# Altium schematic sheet ORD_FV1.SchDoc
size 420 x 297 mm; Address1: Address1; Address2: Address2; Address3: Address3; Address4: Address4; DocumentNumber: АБВГ.123456.001 Э3; SheetNumber: 1; Scale: 1:1; DocumentType: Схема электрическая принципиальная; FirstReferrence: АБВГ.123456.001
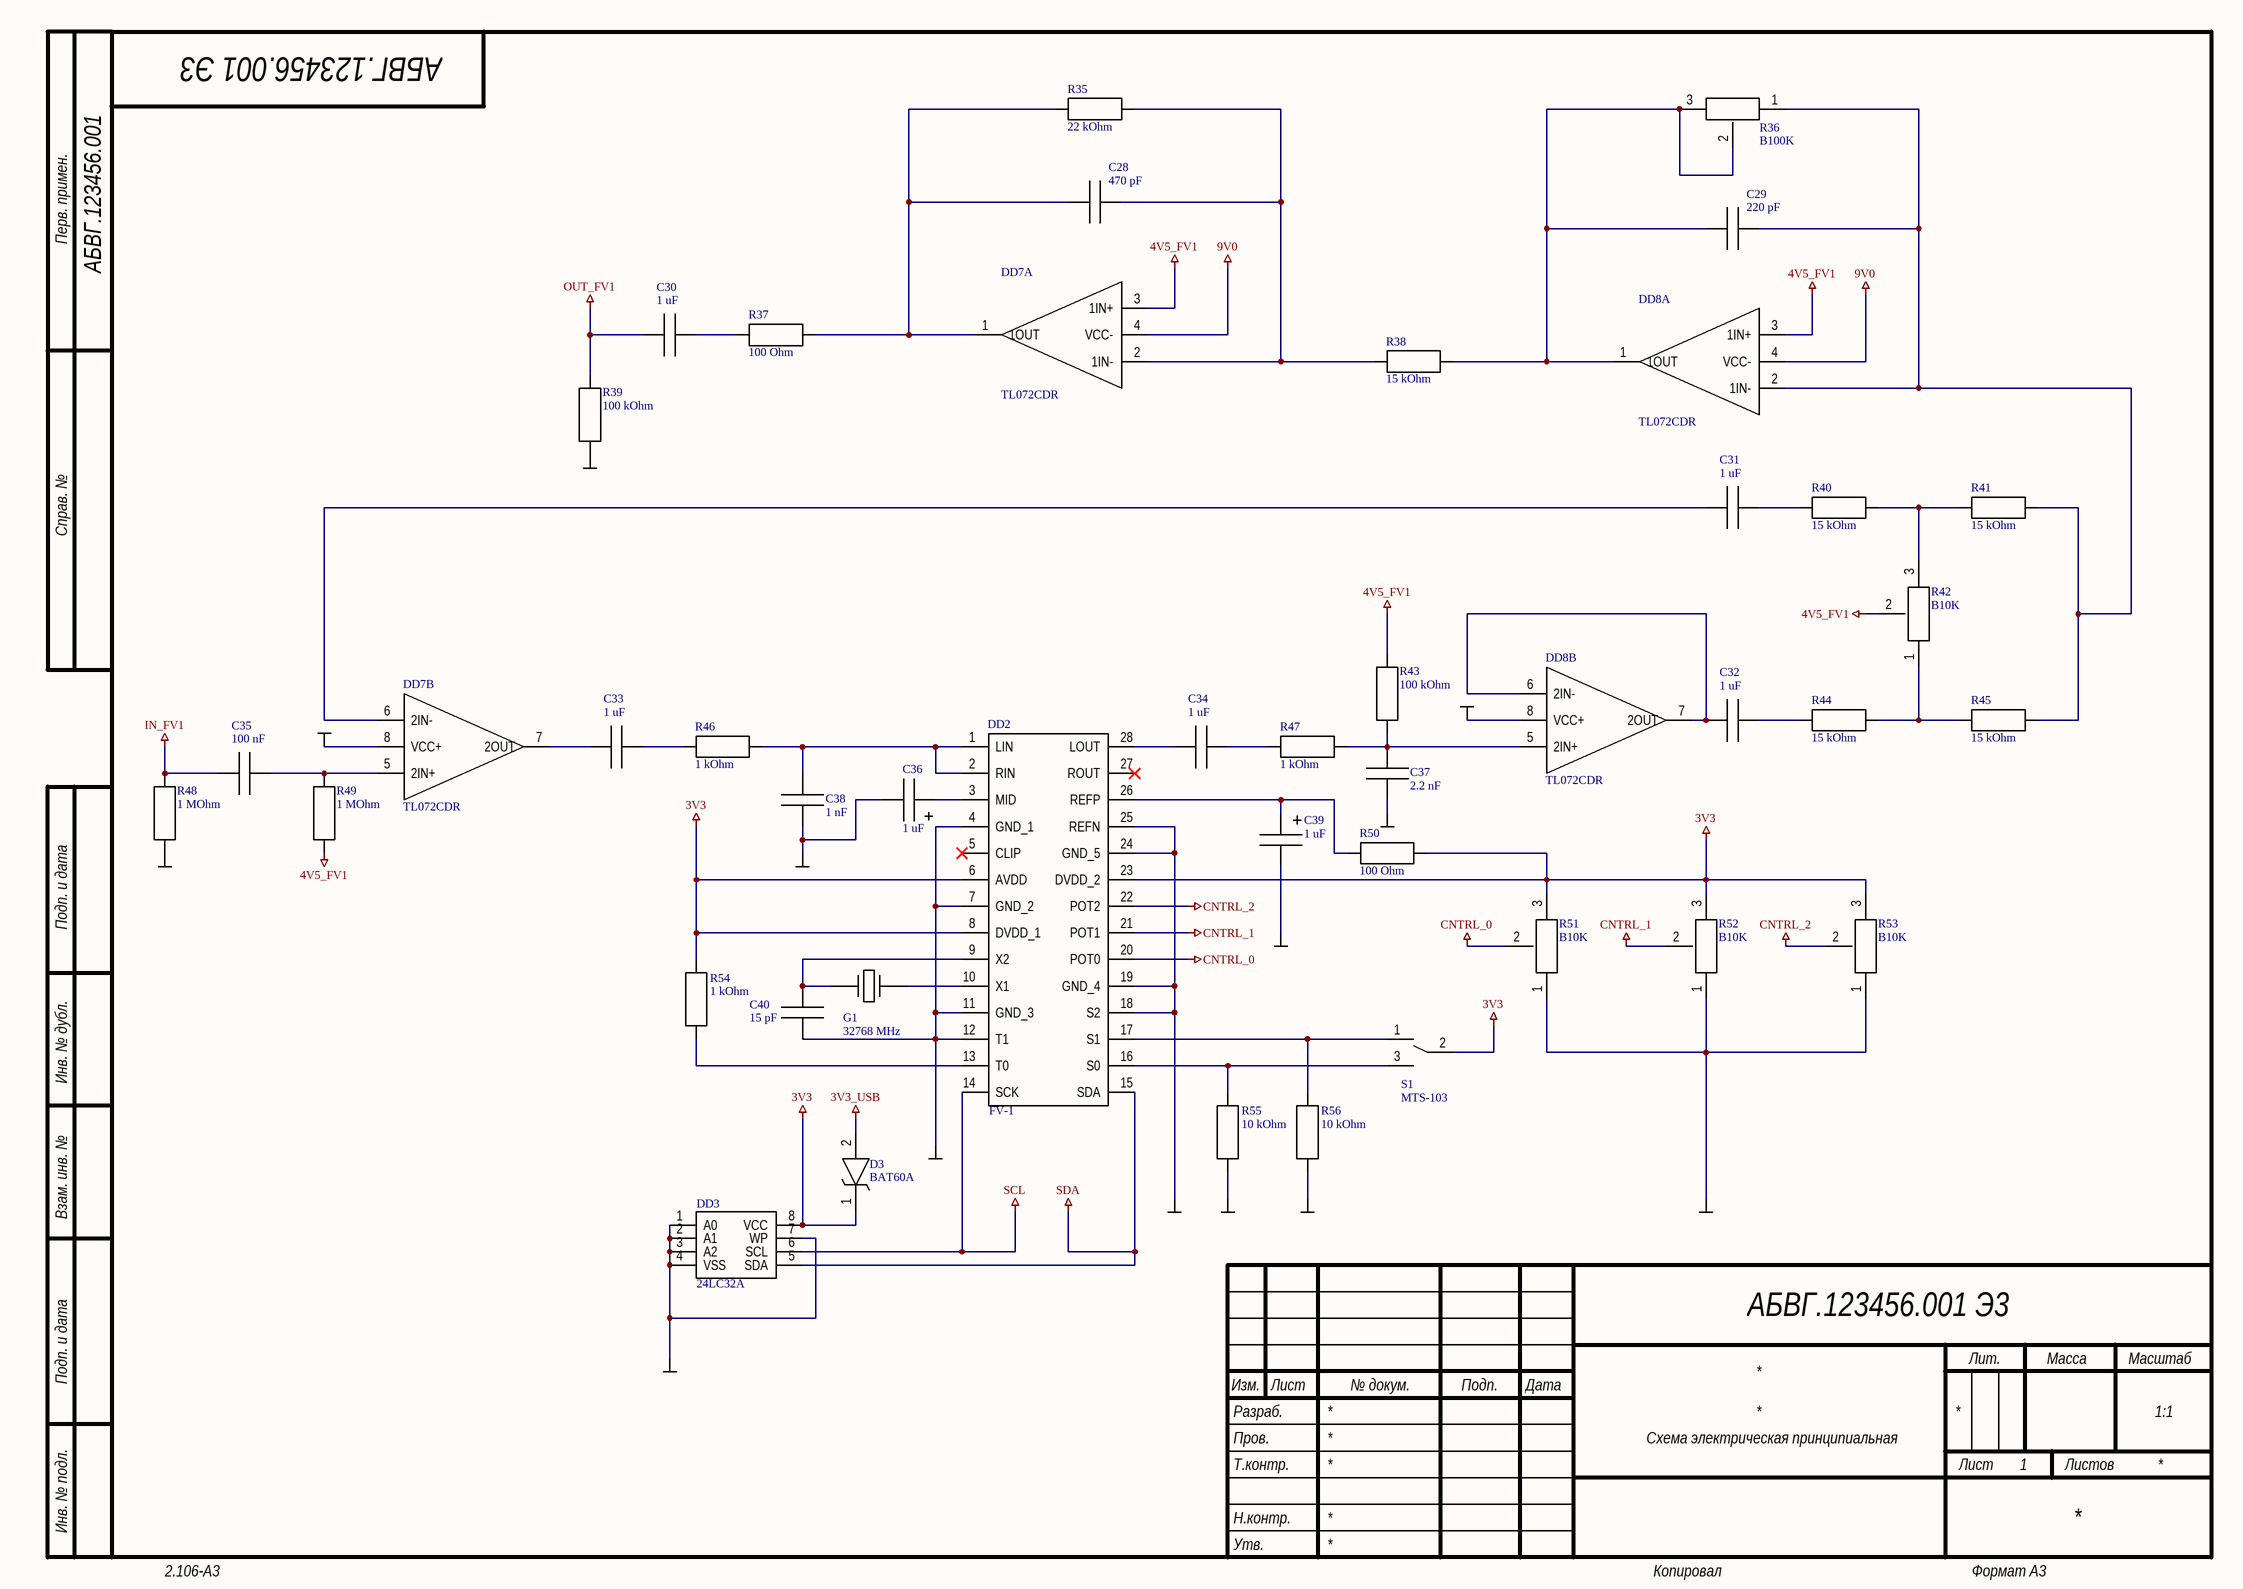
[diagram p0: ORD_FV1.SchDoc]

## Parts
C28  470 pF  [C0805[2012]]
C29  220 pF  [C0805[2012]]
C30  1 uF  [C0805[2012]]
C31  1 uF  [C0805[2012]]
C32  1 uF  [C0805[2012]]
C33  1 uF  [C0805[2012]]
C34  1 uF  [C0805[2012]]
C35  100 nF  [C0805[2012]]
C36  1 uF  [C3216_CASE-A]
C37  2.2 nF  [C0805[2012]]
C38  1 nF  [C0805[2012]]
C39  1 uF  [C3216_CASE-A]
C40  15 pF  [C0805[2012]]
D3  BAT60A  [SOD323]
DD2  FV-1  [SOIC28]
DD3  24LC32A  [DIP8_WITH_SOCKET]
DD7  TL072CDR  [SO8]  (parts A,B of 2)
DD8  TL072CDR  [SO8]  (parts A,B of 2)
G1  32768 MHz  [HC-49]
R35  22 kOhm  [R0805[2012]]
R36  B100K  [16K1]
R37  100 Ohm  [R0805[2012]]
R38  15 kOhm  [R0805[2012]]
R39  100 kOhm  [R0805[2012]]
R40  15 kOhm  [R0805[2012]]
R41  15 kOhm  [R0805[2012]]
R42  B10K  [16K1]
R43  100 kOhm  [R0805[2012]]
R44  15 kOhm  [R0805[2012]]
R45  15 kOhm  [R0805[2012]]
R46  1 kOhm  [R0805[2012]]
R47  1 kOhm  [R0805[2012]]
R48  1 MOhm  [R0805[2012]]
R49  1 MOhm  [R0805[2012]]
R50  100 Ohm  [R0805[2012]]
R51  B10K  [16K1]
R52  B10K  [16K1]
R53  B10K  [16K1]
R54  1 kOhm  [R0805[2012]]
R55  10 kOhm  [R0805[2012]]
R56  10 kOhm  [R0805[2012]]
S1  MTS-103  [MTS-103]

## Nets
3V3: D3.1(K) DD2.6(AVDD) DD2.8(DVDD_1) DD2.23(DVDD_2) DD3.8(VCC) R50.1 R51.3 R52.3 R53.3 R54.2 S1.2
3V3_USB: D3.2(A)
4V5_FV1: DD7.3(1IN+) DD8.3(1IN+) R42.2 R43.1 R49.1
9V0: DD7.4(VCC-) DD8.4(VCC-)
CNTRL_0: DD2.20(POT0) R51.2
CNTRL_1: DD2.21(POT1) R52.2
CNTRL_2: DD2.22(POT2) R53.2
GND: C36.2 C37.1 C38.1 C39.2 C40.2 DD2.4(GND_1) DD2.7(GND_2) DD2.11(GND_3) DD2.12(T1) DD2.18(S2) DD2.19(GND_4) DD2.24(GND_5) DD2.25(REFN) DD3.1(A0) DD3.2(A1) DD3.3(A2) DD3.4(VSS) DD3.7(WP) DD7.8(VCC+) DD8.8(VCC+) R39.1 R48.1 R51.1 R52.1 R53.1 R55.1 R56.1
IN_FV1: C35.1 R48.2
OUT_FV1: C30.1 R39.2
SCL: DD2.14(SCK) DD3.6(SCL)
SDA: DD2.15(SDA) DD3.5(SDA)
NetC28_1: C28.1 DD7.1(1OUT) R35.2 R37.1
NetC28_2: C28.2 DD7.2(1IN-) R35.1 R38.2
NetC29_1: C29.1 DD8.1(1OUT) R36.2 R36.3 R38.1
NetC29_2: C29.2 DD8.2(1IN-) R36.1 R41.1 R45.1
NetC30_2: C30.2 R37.2
NetC31_1: C31.1 DD7.6(2IN-)
NetC31_2: C31.2 R40.2
NetC32_1: C32.1 DD8.6(2IN-) DD8.7(2OUT)
NetC32_2: C32.2 R44.2
NetC33_1: C33.1 DD7.7(2OUT)
NetC33_2: C33.2 R46.2
NetC34_1: C34.1 DD2.28(LOUT)
NetC34_2: C34.2 R47.2
NetC35_2: C35.2 DD7.5(2IN+) R49.2
NetC36_1: C36.1 DD2.3(MID)
NetC37_2: C37.2 DD8.5(2IN+) R43.2 R47.1
NetC38_2: C38.2 DD2.1(LIN) DD2.2(RIN) R46.1
NetC39_1: C39.1 DD2.26(REFP) R50.2
NetC40_1: C40.1 DD2.9(X2) G1.1
NetDD2_10: DD2.10(X1) G1.2
NetDD2_13: DD2.13(T0) R54.1
NetDD2_16: DD2.16(S0) R55.2 S1.3
NetDD2_17: DD2.17(S1) R56.2 S1.1
NetR40_1: R40.1 R41.2 R42.3
NetR42_1: R42.1 R44.1 R45.2

Not connected (* = marked no-connect by the designer): DD2 5(CLIP)* 27(ROUT)*

## Notes on the sheet
- Перв. примен.
- Справ. №
- Подп. и дата
- Инв. № дубл.
- Взам. инв. №
- Разраб.
- Изм.
- Лист
- № докум.
- Подп.
- Дата
- Лит.
- Масса
- Масштаб
- Пров.
- Т.контр.
- Листов
- Инв. № подл.
- Утв.
- Н.контр.
- 2.106-A3
- Копировал
- Формат А3

## Library data of the parts
C28-C35 C37 C38 C40 = Capacitor: Manufacture: *; ManufacturerPartNumber: *; Power/Voltage: *; Quantity: *; Rem: *; TKE: *; Tolerance: *; Корпус: *; Примечание: *
  C28: Value: 470 pF
  C29: Value: 220 pF
  C30-C34: Value: 1 uF
  C35: Value: 100 nF
  C37: Value: 2.2 nF
  C38: Value: 1 nF
  C40: Value: 15 pF
C36 C39 = Capacitor_Pol: Manufacture: *; ManufacturerPartNumber: *; Power/Voltage: *; Quantity: *; Rem: *; TKE: *; Tolerance: *; Value: 1 uF; Корпус: *; Примечание: *
D3 = BAT60A: Diode Schottky 10V 3A Automotive 2-Pin SOD-323 T/R; Manufacturer_Part_Number: BAT60A; Arrow Part Number: BAT60A
DD2 = FV-1: FV-1 Reverb IC, Integrated Stereo ADC & DAC, Integrated Circuit, SOIC-28 300 MIL; Manufacturer_Name: Spin Semiconductor; Geometry.Height: 2.51mm; Manufacturer_Part_Number: FV-1 Reverb IC; Mouser Part Number: *; Mouser Price/Stock: *; RS Part Number: *; RS Price/Stock: *; Datasheet Link: http://www.spinsemi.com/Products/datasheets/spn1001/FV-1.pdf
DD3 = 24LC32A: 32K I2C Serial EEPROM with Quarter-Array Write-Protect; Manufacturer_Name: Microchip; Manufacturer_Part_Number: 24LC32AF-I/P; Allied_Number: 70570177; Mouser Part Number: 579-24LC32AF-I/P; Mouser Price/Stock: https://www.mouser.com/Search/Refine.aspx?Keyword=579-24LC32AF-I%2FP; RS Part Number: *; RS Price/Stock: *; Allied Price/Stock: https://www.alliedelec.com/microchip-technology-inc-24lc32af-i-p/70570177/; Datasheet Link: *
DD7 DD8 = TL072CDR: TL072CDR, Dual Operational Amplifier 4 MHz -18 to 18V, 8-Pin SO; Manufacturer_Name: STMicroelectronics; Manufacturer_Part_Number: LM358DT; Allied_Number: 70013708; Geometry.Height: 1.75mm; Mouser Part Number: 511-LM358DT; Mouser Price/Stock: https://www.mouser.com/Search/Refine.aspx?Keyword=511-LM358DT; RS Part Number: 7140827P; RS Price/Stock: http://uk.rs-online.com/web/p/products/7140827P; Allied Price/Stock: http://www.alliedelec.com/stmicroelectronics-lm358dt/70013708/; Datasheet Link: http://www.st.com/st-web-ui/static/active/en/resource/technical/document/datasheet/CD00000464.pdf
G1 = Crystal_2pin: Value: *
R35 R37-R41 R43-R50 R54-R56 = Resistor: Manufacture: *; ManufacturerPartNumber: *; Power/Voltage: *; Quantity: *; Rem: *; TKE: *; Tolerance: *; Корпус: *; Примечание: *
  R35: Value: 22 kOhm
  R37 R50: Value: 100 Ohm
  R38 R40 R41 R44 R45: Value: 15 kOhm
  R39 R43: Value: 100 kOhm
  R46 R47 R54: Value: 1 kOhm
  R48 R49: Value: 1 MOhm
  R55 R56: Value: 10 kOhm
R36 R42 R51-R53 = 16K1-B (Pot): Value: *; Function: *
S1 = MTS-103: Switch, ON-OFF-ON